# EAGLE design MIDI_Breakout (EAGLE 7.1.0)
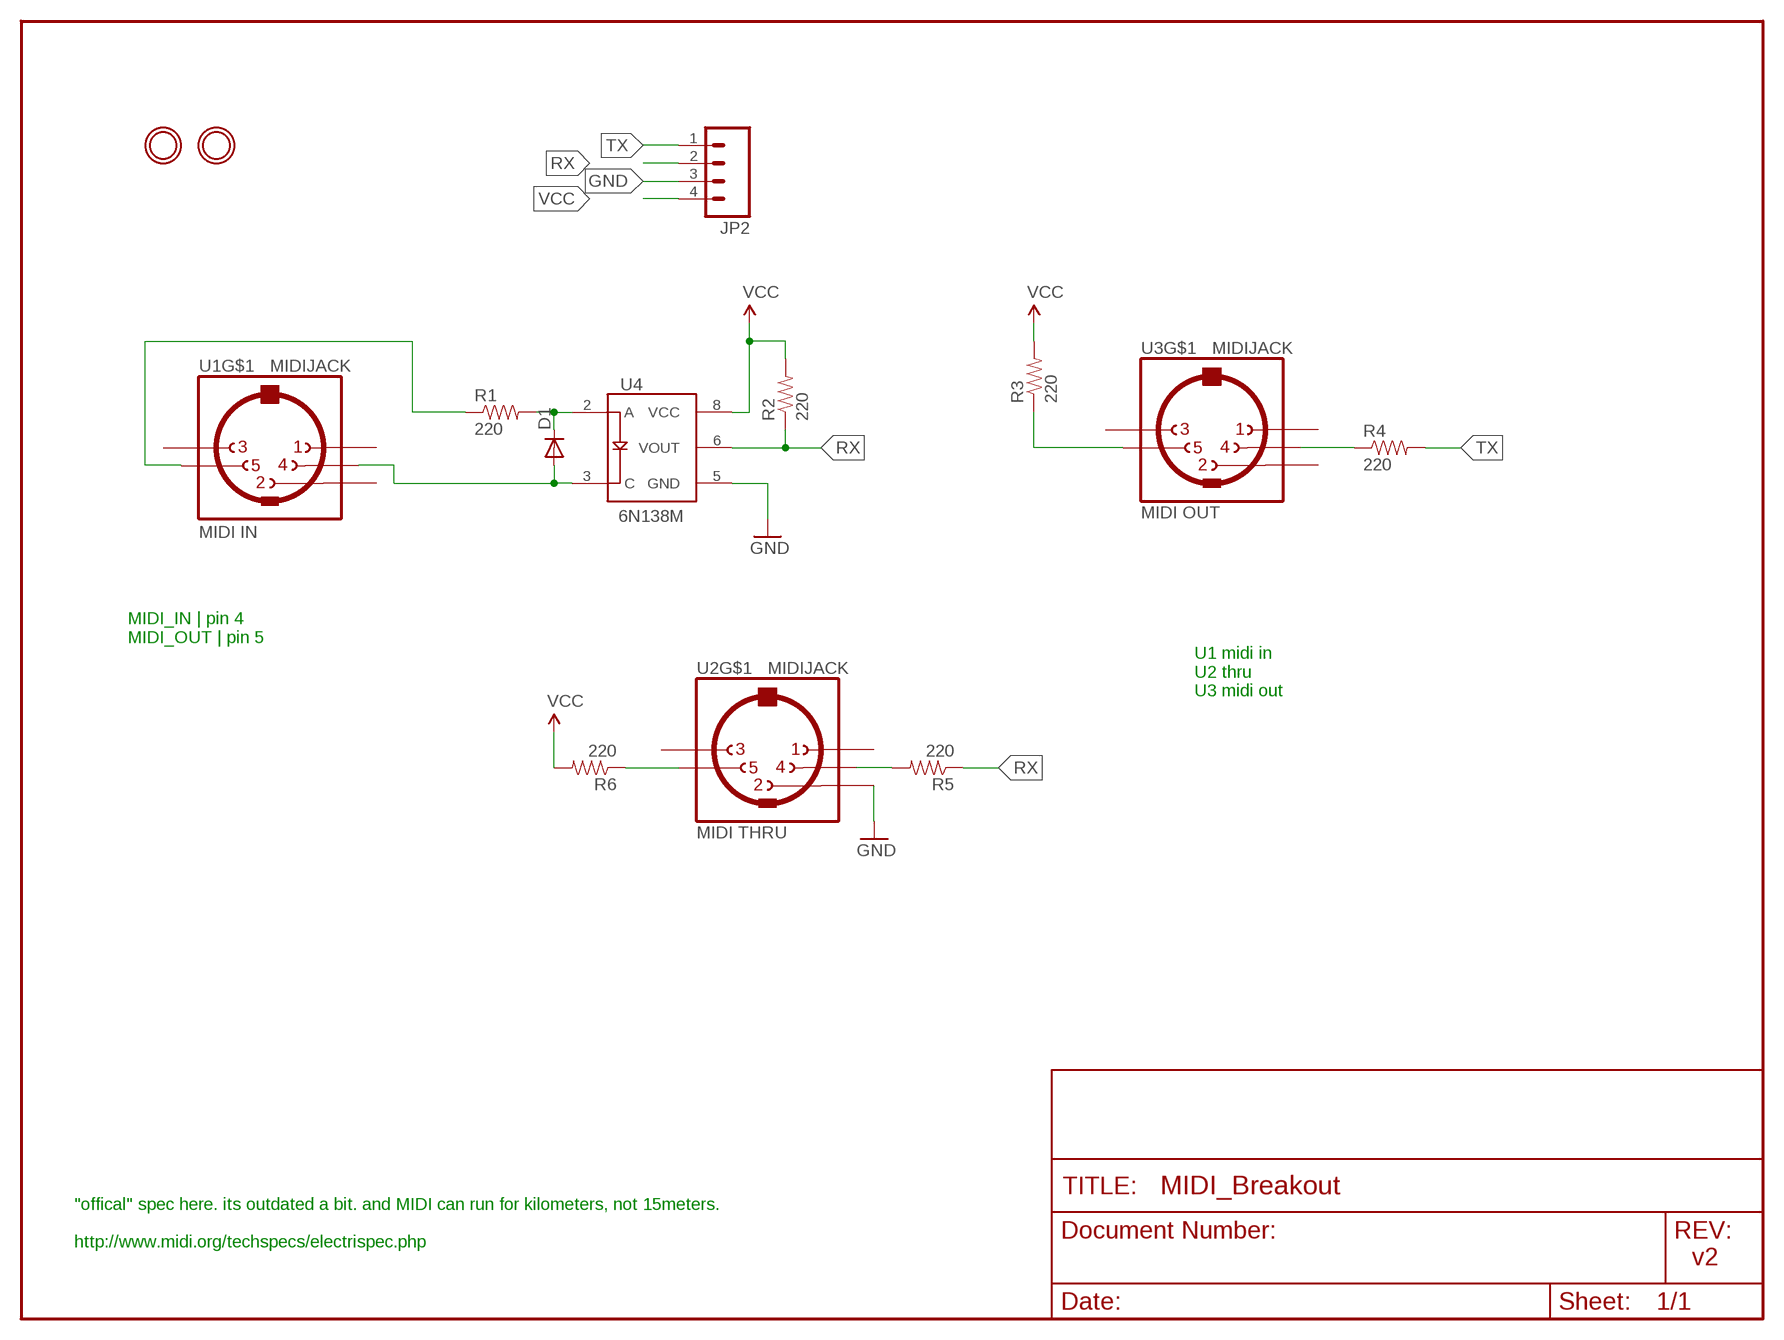
[diagram p0: schematic, sheet 1]

## Parts
D1  DIODESMA  [SMA-DIODE]
JP2  M041X04_NO_SILK  [1X04_NO_SILK]
R1  220  RESISTORPTH-1/2W  [AXIAL-0.5]
R2  220  RESISTORPTH-1/2W  [AXIAL-0.5]
R3  220  RESISTORPTH-1/2W  [AXIAL-0.5]
R4  220  RESISTORPTH-1/2W  [AXIAL-0.5]
R5  220  RESISTORPTH-1/2W  [AXIAL-0.5]
R6  220  RESISTORPTH-1/2W  [AXIAL-0.5]
U1  MIDIJACK  [CP-2350]
U2  MIDIJACK  [CP-2350]
U3  MIDIJACK  [CP-2350]
U4  6N138M  OPTO_DARL_6N138S  [8-SMD]
U$1  MOUNTINGHOLE  [MOUNTINGHOLE_3.0_PLATED]
U$2  MOUNTINGHOLE  [MOUNTINGHOLE_3.0_PLATED]

## Nets
56: D1.C R1.P$2 U4.2(A)
1235: R3.P$1 U3.5
GND: JP2.3 U2.2 U4.5(GND)
N$1: R6.P$1 U2.5
N$2: R5.P$2 U2.4
N$3: R1.P$1 U1.5
N$8: R4.P$1 U3.4
PIN5: D1.A U1.4 U4.3(C)
RX: JP2.2 R2.P$1 R5.P$1 U4.6(VOUT)
TX: JP2.1 R4.P$2
VCC: JP2.4 R2.P$2 R3.P$2 R6.P$2 U4.8(VCC)
Unconnected: U1.1 U1.2 U1.3 U1.PE1(MT) U1.PE2(MT) U1.PE(MT) U1.PE@(MT) U2.1 U2.3 U2.PE1(MT) U2.PE2(MT) U2.PE(MT) U2.PE@(MT) U3.1 U3.2 U3.3 U3.PE1(MT) U3.PE2(MT) U3.PE(MT) U3.PE@(MT)

## Notes on the sheet
- MIDI OUT
- MIDI IN
- MIDI_IN | pin 4
  MIDI_OUT | pin 5
- U1 midi in
  U2 thru
  U3 midi out
- MIDI THRU
- "offical" spec here. its outdated a bit. and MIDI can run for kilometers, not 15meters.
  
  http://www.midi.org/techspecs/electrispec.php
- v2

## Library data of the parts
D1 = SparkFun:DIODE: Diode These are standard reverse protection diodes and small signal diodes. SMA package can handle up to about 1A. SOD-323 can handle about 200mA. What the SOD-323 package when ordering, there are some mfgs out there that are 5-pin packages.
JP2 = SparkFun-Connectors:M04: Header 4 Standard 4-pin 0.1" header. Use with straight break away headers (SKU : PRT-00116), right angle break away headers (PRT-00553), swiss pins (PRT-00743), machine pins (PRT-00117), and female headers (PRT-00115). Molex polarized connector foot print use with SKU : PRT-08231 with associated crimp pins and housings. 1MM SMD Version SKU: PRT-10208
R1-R6 = SparkFun-Resistors:RESISTOR: Resistor Basic schematic elements and footprints for 0603, 1206, and PTH resistors.
U1-U3 = adafruit:MIDIJACK: DIN 5 jack also known as MIDI jack A modification of conn-hirshman:MAB5SH with two options for the grounding 'teeth'
U4 = SparkFun-DiscreteSemi:OPTO_DARL_6N138S: Optoisolator, darlington pair output; PROD_ID: IC-09482
U$1 U$2 = microbuilder:MOUNTINGHOLE: Mounting Hole For #2 screws (0.086"/2.18mm width, 0.094"/2.4mm hole) use 2.5mm

## Board
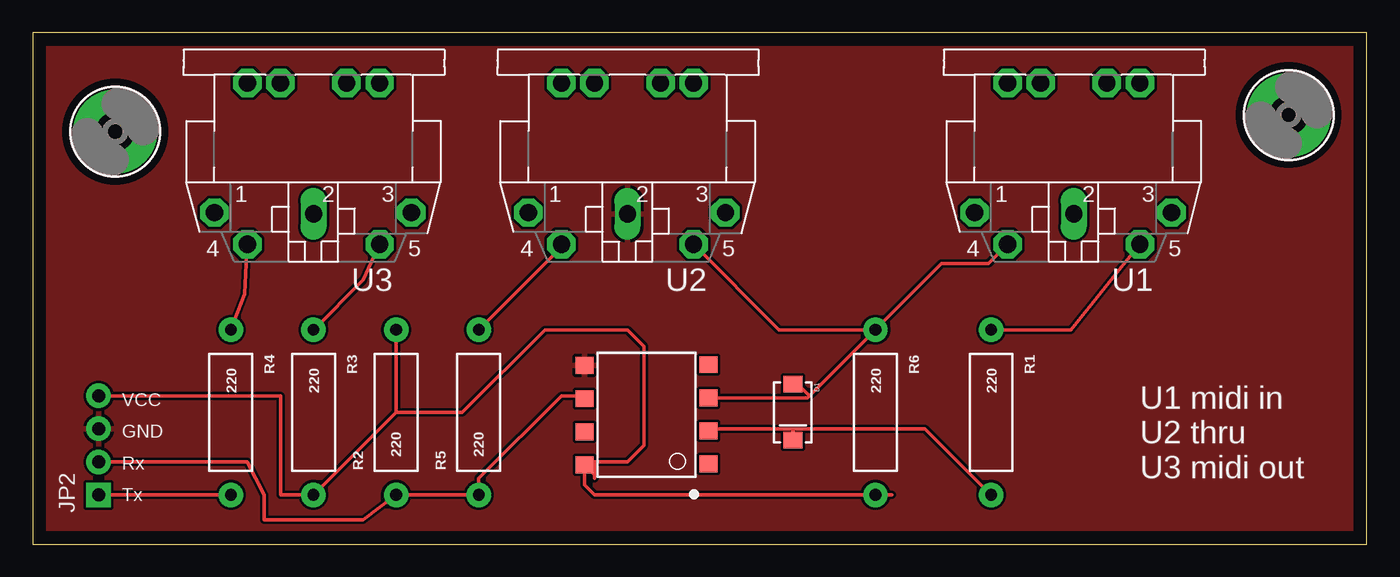
[diagram p1: board, top side]

Size 102.54 x 39.36 mm. Coordinates in mm from the lower left corner, seen from the top.
Outline: 0,0 102.54,0 102.54,39.36 0,39.36 0,0
Copper layers (1*16): Top 0.035mm / dielectric 1.5mm / Bottom 0.035mm
Design rules "default": minimum track width 10mil, minimum drill 0.6mm, track to track 8mil, track to pad 8mil, pad to pad 8mil, via to via 8mil, smd to smd 8mil, copper to edge 40mil, drill to drill 8mil, minimum pad ring 10mil, minimum via ring 8mil, stop-mask expansion 4mil, vias tented up to drill 0mil, thermal gap 10mil

### Footprints (pad centres in the part's own frame; a part is rotated, then mirrored left to right if it is on the bottom)
SMA-DIODE = smd 1.27 x 1.47: A -2.15,0; C 2.15,0
1X04_NO_SILK = drill 1.016 pad 1.88 square: 1 0,0 | drill 1.016 pad 1.88: 2 2.54,0; 3 5.08,0; 4 7.62,0
AXIAL-0.5 = drill 0.9 pad 1.88: P$1 -6.35,0; P$2 6.35,0
CP-2350 = drill 1.321 pad 2.184 octagon: 1 7.62,12.58; 3 -7.52,12.58; 4 5.08,15.02; 5 -5.08,15.02; PE -2.54,2.62; PE1 -5.08,2.62; PE2 5.08,2.62; PE@ 2.54,2.62 | drill 1.321 long: 2 0,12.68
8-SMD = smd 1.3 x 1.4: 1 -3.96,-4.96; 2 -1.42,-4.96; 3 1.12,-4.96; 4 3.66,-4.96; 5 3.59,4.58; 6 1.05,4.58; 7 -1.49,4.58; 8 -4.03,4.58
MOUNTINGHOLE_3.0_PLATED = drill 3 pad 6.452: P$1 0,0

### Placement (x,y rotation side)
D1  58.42,10.16 270 top
JP2  5.08,3.81 90 top
R1  73.66,10.16 270 top
R2  27.94,10.16 90 top
R3  21.59,10.16 270 top
R4  15.24,10.16 270 top
R5  34.29,10.16 90 top
R6  64.77,10.16 270 top
U1  80.01,38.1 180 top
U2  45.72,38.1 180 top
U3  21.59,38.1 180 top
U4  46.99,10.16 90 top
U$1  6.35,31.75 0 top
U$2  96.52,33.02 0 top

### Tracks (layer width: path | path; a pad name or v marks a point on that pad's centre or on a via)
56
  Top 0.254: R1.P$2 68.58,8.89 58.42,8.89 | 58.42,8.89 52.1,8.89 U4.2 | D1.C 58.42,8.89
1235
  Top 0.254: U3.5 25.4,20.32 R3.P$1
GND
  pour Top: -1.27,40.64 -1.27,-1.27 105.41,-1.27 105.41,40.64
N$1
  Top 0.254: R6.P$1 57.37,16.51 U2.5
N$2
  Top 0.254: U2.4 40.64,22.86 R5.P$2
N$3
  Top 0.254: R1.P$1 79.79,16.51 U1.5
N$8
  Top 0.254: U3.4 16.29,19.27 R4.P$1
PIN5
  Top 0.254: U4.3 59.54,11.28 59.69,11.43 | 59.69,11.43 69.85,21.59 73.44,21.59 U1.4 | D1.A 58.81,12.31 59.69,11.43
RX
  Top 0.254: JP2.2 16.51,6.35 17.78,3.81 17.78,1.91 25.4,1.91 R2.P$1 R5.P$1 34.29,5.08 40.64,11.43 42.19,11.43 U4.6
TX
  Top 0.254: JP2.1 R4.P$2
VCC
  Top 0.254: R2.P$2 27.94,10.16 | 27.94,10.16 R3.P$2 19.05,3.81 19.05,11.43 JP2.4 | 66.04,3.81 R6.P$2 43.18,3.81 42.41,4.58 U4.8 43.18,5.36 | 27.94,10.16 33.02,10.16 39.37,16.51 45.72,16.51 46.99,15.24 46.99,7.62 45.72,6.35 43.18,6.35 43.18,5.36 | 43.18,5.08 43.18,5.36

### Text on the board
tNames: U1 midi in / U2 thru / U3 midi out | VCC / GND / Rx / Tx